# Altium project RFR24 AMS Design V1.PrjPcb (part 2 of 2)

## Sheet RFR24 AMS Design - Power Supply V1.SchDoc
size A; SheetNumber: 5; SheetTotal: 10
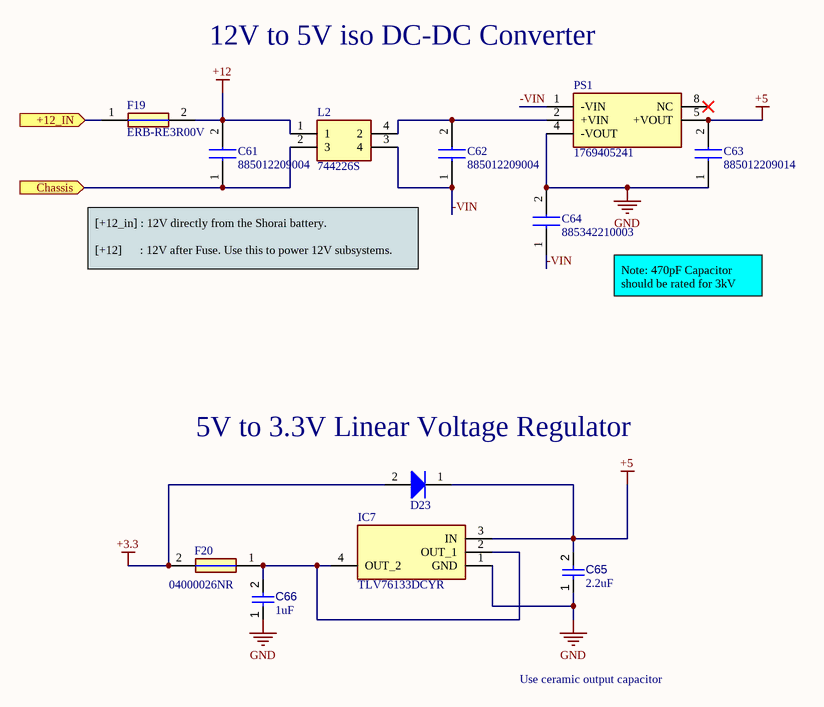
[diagram p4: RFR24 AMS Design - Power Supply V1.SchDoc]

### Parts
C61  885012209004  [CAPC3225X220N]
C62  885012209004  [CAPC3225X220N]
C63  885012209014  [CAPC3225X220N]
C64  885342210003  [CAPC4620X220N]
C65  value 2.2uF  [CAPC2013X145X50LL20T25]  (hidden comment: Capacitor 1 uF +/- 10% 25 V 0805)
C66  value 1uF  [CAPC2013X145X50LL20T25]  (hidden comment: Capacitor 1 uF +/- 10% 25 V 0805)
D23  unknown  [INF-SOD323_V]  (value not drawn)
F19  ERB-RE3R00V  [ERBRE0R50V]
F20  04000026NR  [FUSC1508X58N]
IC7  TLV76133DCYR  [SOT230P700X180-4N]
L2  744226S  [WE-SL274]
PS1  1769405241  [1769405241]

### Ports
+12_IN (in), Chassis (in)

### Nets
+3.3: D23.2(A) F20.2
+5: C63.2 C65.2 D23.1(K) IC7.3(IN) PS1.5(+VOUT)
+12: C61.2 F19.2 L2.1
GND: C63.1 C64.2 C65.1 C66.1 IC7.1(GND) PS1.4(-VOUT)
-VIN: C62.1 C64.1 L2.3(4) PS1.1(-VIN)
Chassis: C61.1 L2.2(3) ; port Chassis
NetC62_2: C62.2 L2.4(2) PS1.2(+VIN)
NetC66_2: C66.2 F20.1 IC7.2(OUT_1) IC7.4(OUT_2)
NetF19_1: F19.1 ; port +12_IN

Not connected (* = marked no-connect by the designer): PS1 8(NC)*

### Notes on the sheet
- 12V to 5V iso DC-DC Converter
- [+12_in] : 12V directly from the Shorai battery.
  [+12]      : 12V after Fuse. Use this to power 12V subsystems.
- Note: 470pF Capacitor should be rated for 3kV
- (near D23) 5V to 3.3V Linear Voltage Regulator
- Use ceramic output capacitor

### Library data of the parts
C61 C62 = 885012209004: Capacitor; Manufacturer_Name: Wurth Elektronik; Datasheet Link: https://katalog.we-online.com/pbs/datasheet/885012209004.pdf; Height: 2.2mm; Manufacturer_Part_Number: 885012209004; Mouser Part Number: 710-885012209004; Mouser Price/Stock: https://www.mouser.com/Search/Refine.aspx?Keyword=710-885012209004
C63 = 885012209014: Capacitor; Manufacturer_Name: Wurth Elektronik; Datasheet Link: https://katalog.we-online.com/pbs/datasheet/885012209014.pdf; Height: 2.2mm; Manufacturer_Part_Number: 885012209014; Mouser Part Number: 710-885012209014; Mouser Price/Stock: https://www.mouser.com/Search/Refine.aspx?Keyword=710-885012209014
C64 = 885342210003: Capacitor; Manufacturer_Name: Wurth Elektronik; Datasheet Link: https://katalog.we-online.com/pbs/datasheet/885342210003.pdf; Height: 2.2mm; Manufacturer_Part_Number: 885342210003; Mouser Part Number: 710-885342210003; Mouser Price/Stock: https://www.mouser.co.uk/ProductDetail/Wurth-Elektronik/885342210003?qs=MLItCLRbWsxO%2Fvro%2Fk5QUQ%3D%3D
C65 C66 = CMP-001-00010-6: Chip Capacitor, 1 uF, +/-10%, 25 V, 0805 (2012 Metric); Capacitor Type: Ceramic; Voltage Rating: 25V; RoHS Compliant: True; Pins: 2; Mounting Technology: SM; Max Operating Temperature: 125°C; Min Operating Temperature: -55°C; Tolerance: 10%; Case/Package: 0805
D23 = CMP-1182-00005-1: Silicon Schottky Diode, -55 to 125 degC, SOD323, Reel, Green; PartNumber: BAS170W; Manufacturer: Infineon; Green: TRUE; VF (max): 1,000Â mV; VR (max): 70Â V; Configuration: Single; CT (max): 2Â pF; IF (max): 70Â mA; PackageReference: SOD323; ComponentLink3URL: http://www.infineon.com/dgdl/SOD323-Package_Overview.pdf?folderId=db3a30431936bc4b011952aab84f3bbe&fileId=db3a30431936bc4b011952beed653be3; PackageDescription: 2-Pin Small Outline Diode Package, 1.25 x 1.7 mm Body; ComponentLink2URL: http://www.infineon.com/dgdl/bas70_bas170series.pdf?folderId=db3a30431400ef68011425f1ca2505e3&fileId=db3a304314dca389011518ad41680e12; ComponentLink3Description: Package Specification; ComponentLink1URL: http://www.infineon.com/; ComponentLink1Description: Manufacturer URL; Packing: Reel; ComponentLink2Description: Datasheet; Mounting Technology: Surface Mount
F19 = ERB-RE3R00V: Fuse; Manufacturer_Name: Panasonic; Datasheet Link: https://industrial.panasonic.com/cdbs/www-data/pdf/AFA0000/AFA0000C7.pdf; Height: 0.64mm; Manufacturer_Part_Number: ERB-RE3R00V; Mouser Part Number: 667-ERB-RE3R00V; Mouser Price/Stock: https://www.mouser.co.uk/ProductDetail/Panasonic/ERB-RE3R00V?qs=YIEcsSB2Lz476AVmswLSkg%3D%3D; Arrow Part Number: ERB-RE3R00V; Arrow Price/Stock: https://www.arrow.com/en/products/erbre3r00v/panasonic?region=nac
F20 = 04000026NR: Fuse; Manufacturer_Name: LITTELFUSE; Datasheet Link: https://www.mouser.com/catalog/specsheets/Littelfuse_07032019_Fuse_400M_Datasheet.pdf; Height: 0.582mm; Manufacturer_Part_Number: 04000026NR; Mouser Part Number: 576-04000026NR; Mouser Price/Stock: https://www.mouser.co.uk/ProductDetail/Littelfuse/04000026NR?qs=byeeYqUIh0MItL5FgjMqyw%3D%3D; Arrow Part Number: 04000026NR; Arrow Price/Stock: https://www.arrow.com/en/products/04000026nr/littelfuse?region=nac
IC7 = TLV76133DCYR: Integrated Circuit; Manufacturer_Name: Texas Instruments; Datasheet Link: https://www.ti.com/lit/ds/symlink/tlv761.pdf?ts=1679984111185&ref_url=https%253A%252F%252Fwww.ti.com%252Fsitesearch%252Fen-us%252Fdocs%252Funiversalsearch.tsp%253FlangPref%253Den-US%2526searchTerm%253DTLV76133DCYR%2526nr%253D2; Height: 1.8mm; Manufacturer_Part_Number: TLV76133DCYR; Mouser Part Number: 595-TLV76133DCYR; Mouser Price/Stock: https://www.mouser.co.uk/ProductDetail/Texas-Instruments/TLV76133DCYR?qs=9vOqFld9vZV5BPjUhjTZUA%3D%3D; Arrow Part Number: TLV76133DCYR; Arrow Price/Stock: https://www.arrow.com/en/products/tlv76133dcyr/texas-instruments?region=nac
L2 = 744226S: Inductor; Manufacturer_Name: Wurth Elektronik; Datasheet Link: http://componentsearchengine.com/Datasheets/3/744226S.pdf; Manufacturer_Part_Number: 744226S; Mouser Part Number: 710-744226S; Mouser Price/Stock: https://www.mouser.co.uk/ProductDetail/Wurth-Elektronik/744226S?qs=PGXP4M47uW7i1tILwHyAXg%3D%3D
PS1 = 1769405241: Power Supply; Manufacturer_Name: Wurth Elektronik; Datasheet Link: https://www.we-online.com/components/products/datasheet/1769405241.pdf; Height: 7.5mm; Manufacturer_Part_Number: 1769405241

## Sheet RFR24 AMS Design - CAN V1.SchDoc
size A; SheetNumber: 6; SheetTotal: 10
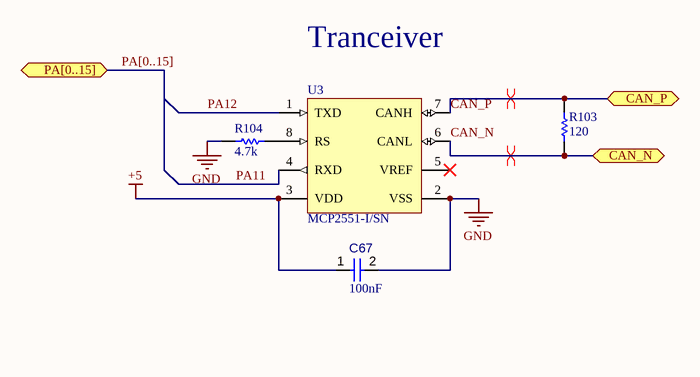
[diagram p5: RFR24 AMS Design - CAN V1.SchDoc]

### Parts
C67  value 100nF  [CAPC2013X145X50LL20T25]  (hidden comment: Capacitor 1 uF +/- 10% 25 V 0805)
R103  value 120  [RESC2013X70X40LL20T20]  (hidden comment: Resistor 1k +/-1% 0805 125 mW)  (no BOM)
R104  value 4.7k  [RESC2013X70X40LL20T20]  (hidden comment: Resistor 1k +/-1% 0805 125 mW)
U3  MCP2551-I/SN  [MCHP-SN8_V]

### Ports
CAN_N (bidir), CAN_P (bidir), PA[0..15] (bidir)

### Nets
+5: C67.1 U3.3(VDD)
GND: C67.2 R104.1 U3.2(VSS)
CAN_N: R103.2 U3.6(CANL) ; port CAN_N
CAN_P: R103.1 U3.7(CANH) ; port CAN_P
PA11: U3.4(RXD)
PA12: U3.1(TXD)
NetR104_2: R104.2 U3.8(RS)

Not connected (* = marked no-connect by the designer): U3 5(VREF)*

### Buses and harness runs
bus PA[0..15] = port PA[0..15]

### Layout directives
differential pair; rule Differential Pairs Routing [Pref Gap = 10mil    Min Gap  = 4mil    Max Gap  = 10milPref Width = 12mil    Min Width  = 7mil    Max Width  = 12mil]: CAN_P
differential pair: CAN_N

### Notes on the sheet
- Tranceiver

### Library data of the parts
C67 = CMP-001-00010-6: as C65 on sheet RFR24 AMS Design - Power Supply V1; RoHS Compliant: True; Pins: 2; Mounting Technology: SM; Max Operating Temperature: 125°C; Min Operating Temperature: -55°C; Tolerance: 10%; Case/Package: 0805
R103 R104 = CMP-009-00010-5: Chip Resistor, 1 KOhm, +/- 1%, 0.125 W, -55 to 155 degC, 0805 (2013 Metric); Power: 125mW; Voltage Rating: 150V; Tolerance: 1%; RoHS Compliant: True; Mounting Technology: SM; Pins: 2; Case/Package: 0805; Max Operating Temperature: 155°C; Min Operating Temperature: -55°C
U3 = CMP-0186-00138-3: High-Speed CAN Transceiver, / 1 Mb/s, 4.5 to 5.5 V, 8-Pin SOIC (SN), Industrial Temperature, RoHS, Tube; Manufacturer: Microchip; RoHSCompliant: true; PackageReference: SN8; ComponentLink1URL: http://www.microchip.com/; DatasheetVersion: Rev. F, 07/2010; ComponentLink2Description: Datasheet; ComponentLink2URL: http://ww1.microchip.com/downloads/en/DeviceDoc/21667f.pdf; ComponentLink3Description: Package Specification; PackageDescription: 8-Pin Small Outline Integrated Circuit, Body 4.9 x 3.9 mm, Pitch 1.27 mm; ComponentLink1Description: Manufacturer URL; Mounting Technology: Surface Mount; ComponentLink3URL: http://www.microchip.com/stellent/groups/techpub_sg/documents/packagingspec/en012702.pdf

## Sheet RFR24 AMS Design - EEPROM V1.SchDoc
size A; SheetNumber: 7; SheetTotal: 10
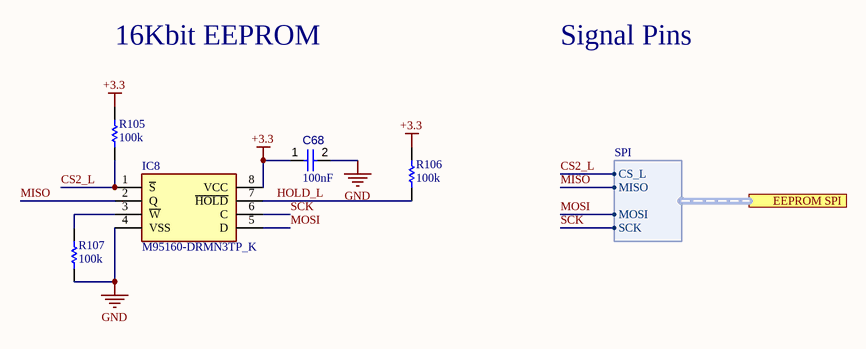
[diagram p6: RFR24 AMS Design - EEPROM V1.SchDoc]

### Parts
C68  value 100nF  [CAPC2013X145X50LL20T25]  (hidden comment: Capacitor 1 uF +/- 10% 25 V 0805)
IC8  M95160-DRMN3TP_K  [SOIC127P600X175-8N]
R105  value 100k  [RESC2013X70X40LL20T20]  (hidden comment: Resistor 1k +/-1% 0805 125 mW)
R106  value 100k  [RESC2013X70X40LL20T20]  (hidden comment: Resistor 1k +/-1% 0805 125 mW)
R107  value 100k  [RESC2013X70X40LL20T20]  (hidden comment: Resistor 1k +/-1% 0805 125 mW)

### Ports
EEPROM SPI (harness SPI)

### Harnesses
SPI: CS_L, MISO, MOSI, SCK

### Nets
+3.3: C68.1 IC8.8(VCC) R105.2 R106.2
GND: C68.2 IC8.4(VSS) R107.1
CS2_L: IC8.1(~{S}) R105.1 ; port EEPROM SPI.CS_L
HOLD_L: IC8.7(~{HOLD}) R106.1
MISO: IC8.2(Q) ; port EEPROM SPI.MISO
MOSI: IC8.5(D) ; port EEPROM SPI.MOSI
SCK: IC8.6(C) ; port EEPROM SPI.SCK  [project net PA5]
NetIC8_3: IC8.3(~{W}) R107.2

### Notes on the sheet
- 16Kbit EEPROM
- Signal Pins

### Library data of the parts
C68 = CMP-001-00010-6: as C65 on sheet RFR24 AMS Design - Power Supply V1; RoHS Compliant: True; Pins: 2; Mounting Technology: SM; Max Operating Temperature: 125°C; Min Operating Temperature: -55°C; Tolerance: 10%; Case/Package: 0805
IC8 = M95160-DRMN3TP_K: Integrated Circuit; Manufacturer_Name: STMicroelectronics; Manufacturer_Part_Number: M95160-DRMN3TP/K; Datasheet Link: https://www.mouser.jp/datasheet/2/389/dm00066376-1797784.pdf; Height: 1.75mm; Mouser Part Number: 511-M95160-DRMN3TP/K; Mouser Price/Stock: https://www.mouser.co.uk/ProductDetail/STMicroelectronics/M95160-DRMN3TP-K?qs=4ccVDqXDOrm%252BfzFwsEAdxA%3D%3D; Arrow Part Number: M95160-DRMN3TP/K; Arrow Price/Stock: https://www.arrow.com/en/products/m95160-drmn3tpk/stmicroelectronics?region=nac
R105-R107 = CMP-009-00010-5: as R103 on sheet RFR24 AMS Design - CAN V1; Tolerance: 1%; RoHS Compliant: True; Mounting Technology: SM; Pins: 2; Case/Package: 0805; Max Operating Temperature: 155°C; Min Operating Temperature: -55°C

## Sheet RFR24 AMS Design - Thermistors V1.SchDoc
size A; SheetNumber: 8; SheetTotal: 10
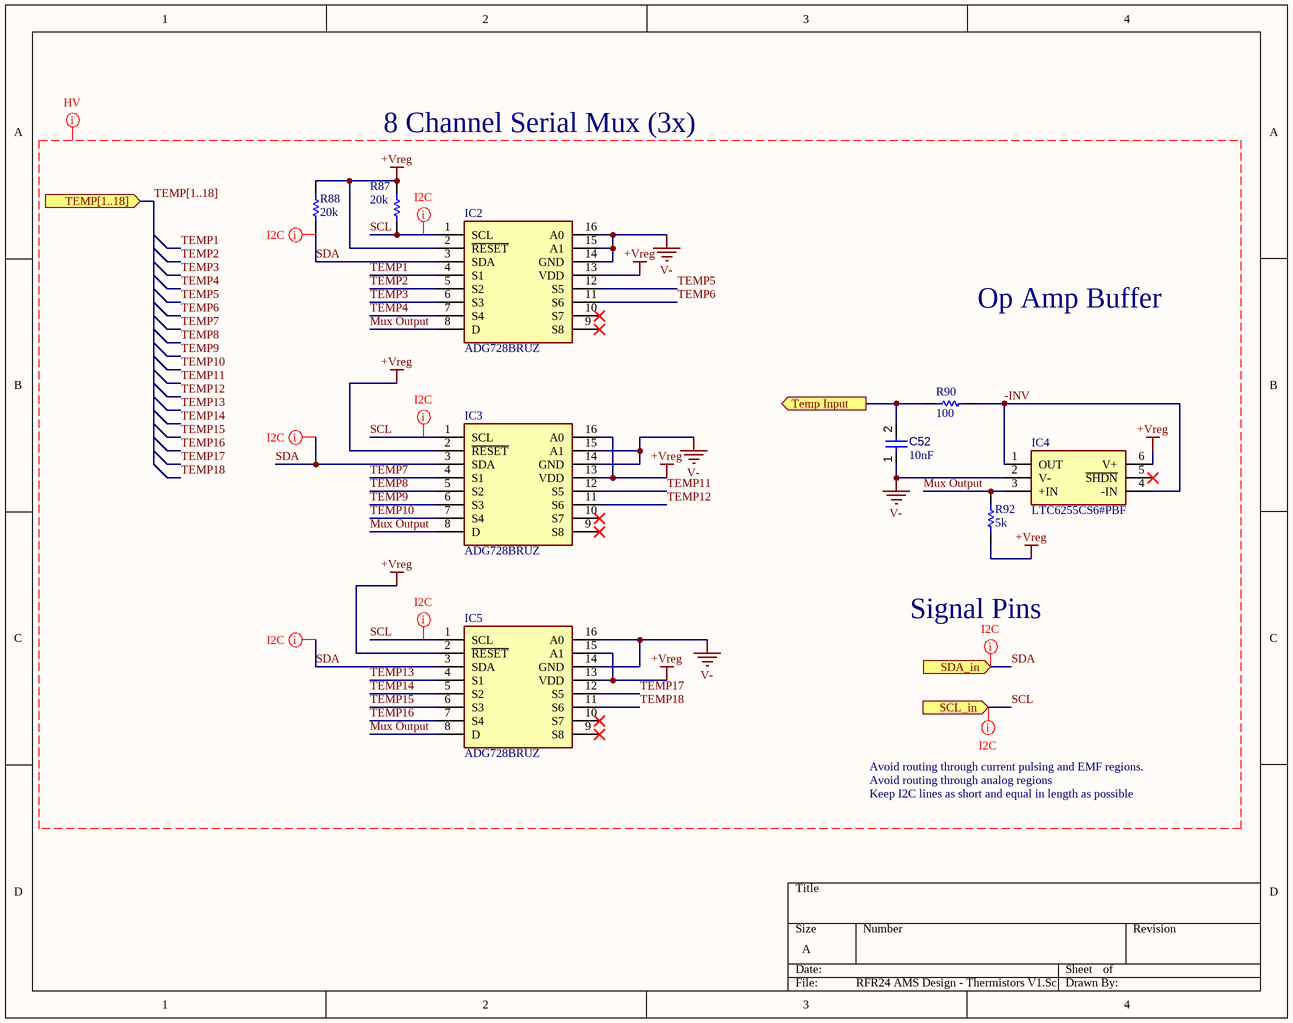
[diagram p7: RFR24 AMS Design - Thermistors V1.SchDoc]

### Parts
C52  value 10nF  [CAPC2013X145X50LL20T25]  (hidden comment: Capacitor 1 uF +/- 10% 25 V 0805)
IC2  ADG728BRUZ  [SOP65P640X120-16N]
IC3  ADG728BRUZ  [SOP65P640X120-16N]
IC4  LTC6255CS6#PBF  [SOT95P280X100-6N]
IC5  ADG728BRUZ  [SOP65P640X120-16N]
R87  value 20k  [RESC2013X70X40LL20T20]  (hidden comment: Resistor 1k +/-1% 0805 125 mW)
R88  value 20k  [RESC2013X70X40LL20T20]  (hidden comment: Resistor 1k +/-1% 0805 125 mW)
R90  value 100  [RESC2013X70X40LL20T20]  (hidden comment: Resistor 1k +/-1% 0805 125 mW)
R92  value 5k  [RESC2013X70X40LL20T20]  (hidden comment: Resistor 1k +/-1% 0805 125 mW)

### Ports
SCL_in (in), SDA_in (in), Temp Input (out), TEMP[1..18] (in)

### Nets
+Vreg: IC2.2(~{RESET}) IC2.13(VDD) IC3.2(~{RESET}) IC3.13(VDD) IC3.16(A0) IC4.6(V+) IC5.2(~{RESET}) IC5.13(VDD) IC5.15(A1) R87.2 R88.2 R92.1
V-: C52.1 IC2.14(GND) IC2.15(A1) IC2.16(A0) IC3.14(GND) IC3.15(A1) IC4.2(V-) IC5.14(GND) IC5.16(A0)
-INV: IC4.1(OUT) IC4.4(-IN) R90.1
Mux Output: IC2.8(D) IC3.8(D) IC4.3(+IN) IC5.8(D) R92.2
SCL: IC2.1(SCL) IC3.1(SCL) IC5.1(SCL) R87.1 ; port SCL_in
SDA: IC2.3(SDA) IC3.3(SDA) IC5.3(SDA) R88.1 ; port SDA_in
TEMP1: IC2.4(S1)
TEMP2: IC2.5(S2)
TEMP3: IC2.6(S3)
TEMP4: IC2.7(S4)
TEMP5: IC2.12(S5)
TEMP6: IC2.11(S6)
TEMP7: IC3.4(S1)
TEMP8: IC3.5(S2)
TEMP9: IC3.6(S3)
TEMP10: IC3.7(S4)
TEMP11: IC3.12(S5)
TEMP12: IC3.11(S6)
TEMP13: IC5.4(S1)
TEMP14: IC5.5(S2)
TEMP15: IC5.6(S3)
TEMP16: IC5.7(S4)
TEMP17: IC5.12(S5)
TEMP18: IC5.11(S6)
Temp Input: C52.2 R90.2 ; port Temp Input

Not connected (* = marked no-connect by the designer): IC2 9(S8)* 10(S7)*; IC3 9(S8)* 10(S7)*; IC4 5(~{SHDN})*; IC5 9(S8)* 10(S7)*

### Buses and harness runs
bus TEMP[1..18] = port TEMP[1..18]

### Layout directives
net class HV: +Vreg, -INV, Mux Output, SCL, SDA, TEMP1, TEMP2, TEMP3, TEMP4, TEMP5, TEMP6, TEMP7, TEMP8, TEMP9, TEMP10, TEMP11, TEMP12, TEMP13, TEMP14, TEMP15, TEMP16, TEMP17, TEMP18, TEMP[1..18], V-
rule Matched Net Lengths [Tolerance = 1000mil]; net class I2C: SCL, SDA

### Notes on the sheet
- 8 Channel Serial Mux (3x)
- Op Amp Buffer
- Signal Pins
- Avoid routing through current pulsing and EMF regions.
- Keep I2C lines as short and equal in length as possible
- Avoid routing through analog regions

### Library data of the parts
C52 = CMP-001-00010-6: as C65 on sheet RFR24 AMS Design - Power Supply V1; RoHS Compliant: True; Pins: 2; Mounting Technology: SM; Max Operating Temperature: 125°C; Min Operating Temperature: -55°C; Tolerance: 10%; Case/Package: 0805
IC2 IC3 IC5 = ADG728BRUZ: Integrated Circuit; Manufacturer_Name: Analog Devices; Datasheet Link: http://www.analog.com/static/imported-files/data_sheets/ADG728_729.pdf; Height: 1.2mm; Manufacturer_Part_Number: ADG728BRUZ; Mouser Part Number: 584-ADG728BRUZ; Mouser Price/Stock: https://www.mouser.co.uk/ProductDetail/Analog-Devices/ADG728BRUZ?qs=BpaRKvA4VqGXEyZecHfmEg%3D%3D; Arrow Part Number: ADG728BRUZ; Arrow Price/Stock: https://www.arrow.com/en/products/adg728bruz/analog-devices?region=europe
IC4 = LTC6255CS6#PBF: Integrated Circuit; Manufacturer_Name: Analog Devices; Datasheet Link: https://eu.mouser.com/ProductDetail/Analog-Devices/LTC6255CS6PBF?qs=hVkxg5c3xu%252Bj7bFOzXeTRA%3D%3D; Height: 1mm; Manufacturer_Part_Number: LTC6255CS6#PBF
R87 R88 R90 R92 = CMP-009-00010-5: as R103 on sheet RFR24 AMS Design - CAN V1; Tolerance: 1%; RoHS Compliant: True; Mounting Technology: SM; Pins: 2; Case/Package: 0805; Max Operating Temperature: 155°C; Min Operating Temperature: -55°C

## Sheet RFR24 AMS Design - Fuses V1.SchDoc
size A; SheetNumber: 9; SheetTotal: 10
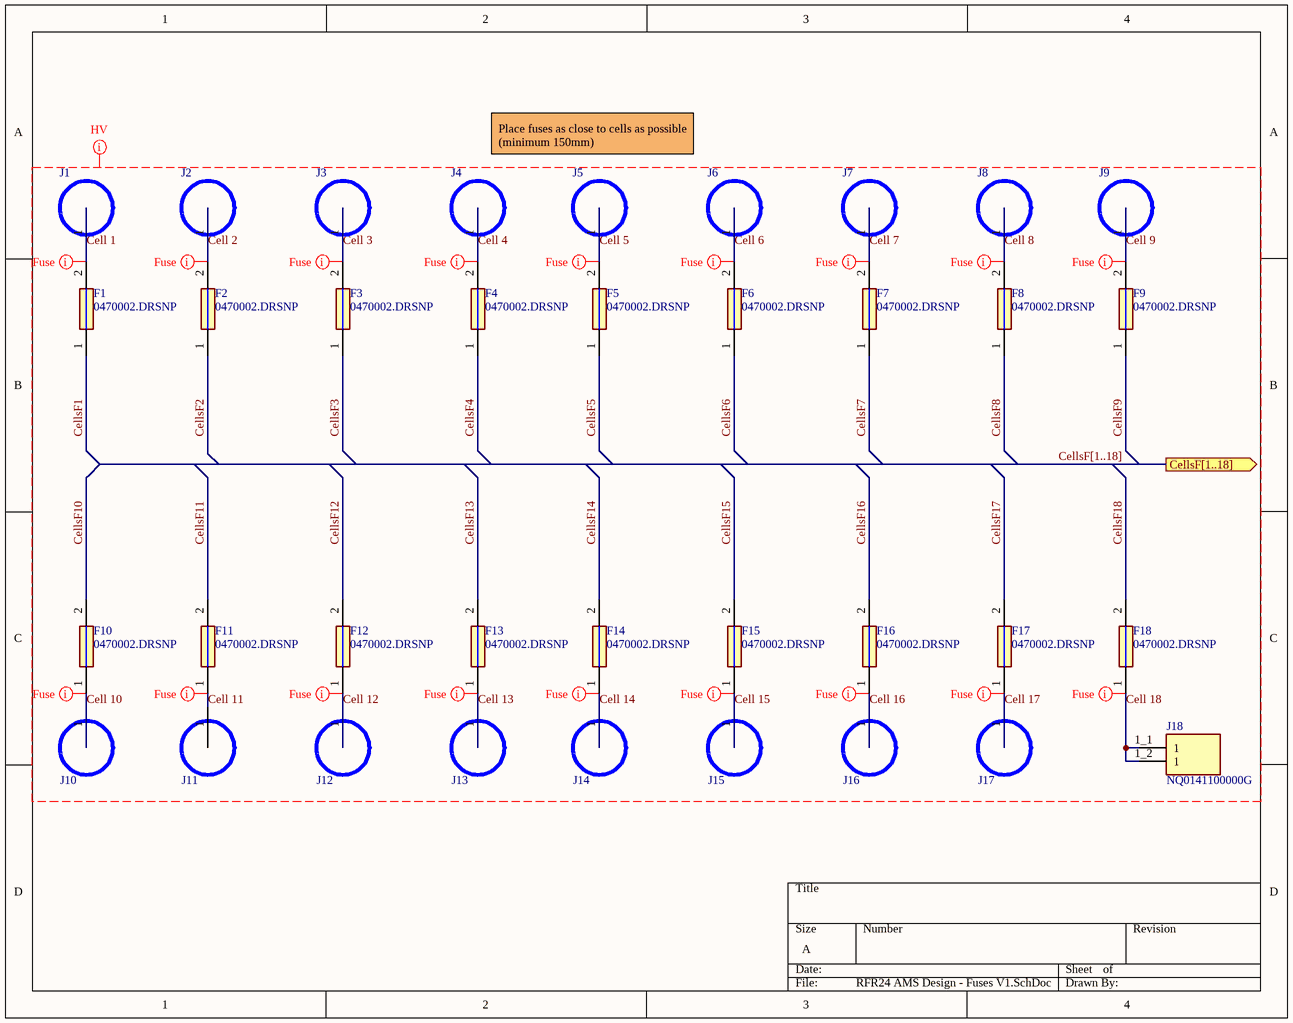
[diagram p8: RFR24 AMS Design - Fuses V1.SchDoc]

### Parts
F1  0470002.DRSNP  [0470002DRSNP]
F2  0470002.DRSNP  [0470002DRSNP]
F3  0470002.DRSNP  [0470002DRSNP]
F4  0470002.DRSNP  [0470002DRSNP]
F5  0470002.DRSNP  [0470002DRSNP]
F6  0470002.DRSNP  [0470002DRSNP]
F7  0470002.DRSNP  [0470002DRSNP]
F8  0470002.DRSNP  [0470002DRSNP]
F9  0470002.DRSNP  [0470002DRSNP]
F10  0470002.DRSNP  [0470002DRSNP]
F11  0470002.DRSNP  [0470002DRSNP]
F12  0470002.DRSNP  [0470002DRSNP]
F13  0470002.DRSNP  [0470002DRSNP]
F14  0470002.DRSNP  [0470002DRSNP]
F15  0470002.DRSNP  [0470002DRSNP]
F16  0470002.DRSNP  [0470002DRSNP]
F17  0470002.DRSNP  [0470002DRSNP]
F18  0470002.DRSNP  [0470002DRSNP]
J1  2900-3-15-20-75-14-11-0  [2900-3-15-20-75-14-11-0-Footprint-1]  (value not drawn)
J2  2900-3-15-20-75-14-11-0  [2900-3-15-20-75-14-11-0-Footprint-1]  (value not drawn)
J3  2900-3-15-20-75-14-11-0  [2900-3-15-20-75-14-11-0-Footprint-1]  (value not drawn)
J4  2900-3-15-20-75-14-11-0  [2900-3-15-20-75-14-11-0-Footprint-1]  (value not drawn)
J5  2900-3-15-20-75-14-11-0  [2900-3-15-20-75-14-11-0-Footprint-1]  (value not drawn)
J6  2900-3-15-20-75-14-11-0  [2900-3-15-20-75-14-11-0-Footprint-1]  (value not drawn)
J7  2900-3-15-20-75-14-11-0  [2900-3-15-20-75-14-11-0-Footprint-1]  (value not drawn)
J8  2900-3-15-20-75-14-11-0  [2900-3-15-20-75-14-11-0-Footprint-1]  (value not drawn)
J9  2900-3-15-20-75-14-11-0  [2900-3-15-20-75-14-11-0-Footprint-1]  (value not drawn)
J10  2900-3-15-20-75-14-11-0  [2900-3-15-20-75-14-11-0-Footprint-1]  (value not drawn)
J11  2900-3-15-20-75-14-11-0  [2900-3-15-20-75-14-11-0-Footprint-1]  (value not drawn)
J12  2900-3-15-20-75-14-11-0  [2900-3-15-20-75-14-11-0-Footprint-1]  (value not drawn)
J13  2900-3-15-20-75-14-11-0  [2900-3-15-20-75-14-11-0-Footprint-1]  (value not drawn)
J14  2900-3-15-20-75-14-11-0  [2900-3-15-20-75-14-11-0-Footprint-1]  (value not drawn)
J15  2900-3-15-20-75-14-11-0  [2900-3-15-20-75-14-11-0-Footprint-1]  (value not drawn)
J16  2900-3-15-20-75-14-11-0  [2900-3-15-20-75-14-11-0-Footprint-1]  (value not drawn)
J17  2900-3-15-20-75-14-11-0  [2900-3-15-20-75-14-11-0-Footprint-1]  (value not drawn)
J18  NQ0141100000G  [AMPHENOL_NQ0141100000G]

### Ports
CellsF[1..18] (out)

### Nets
Cell 1: F1.2 J1.1
Cell 2: F2.2 J2.1
Cell 3: F3.2 J3.1
Cell 4: F4.2 J4.1
Cell 5: F5.2 J5.1
Cell 6: F6.2 J6.1
Cell 7: F7.2 J7.1
Cell 8: F8.2 J8.1
Cell 9: F9.2 J9.1
Cell 10: F10.1 J10.1
Cell 11: F11.1 J11.1
Cell 12: F12.1 J12.1
Cell 13: F13.1 J13.1
Cell 14: F14.1 J14.1
Cell 15: F15.1 J15.1
Cell 16: F16.1 J16.1
Cell 17: F17.1 J17.1
Cell 18: F18.1 J18.1_1(1) J18.1_2(1)
CellsF1: F1.1
CellsF2: F2.1
CellsF3: F3.1
CellsF4: F4.1
CellsF5: F5.1
CellsF6: F6.1
CellsF7: F7.1
CellsF8: F8.1
CellsF9: F9.1
CellsF10: F10.2
CellsF11: F11.2
CellsF12: F12.2
CellsF13: F13.2
CellsF14: F14.2
CellsF15: F15.2
CellsF16: F16.2
CellsF17: F17.2
CellsF18: F18.2

### Buses and harness runs
bus CellsF[1..18] = port CellsF[1..18]

### Layout directives
net class HV; rule Width Constraint [Pref Width = 0.254mm    Min Width = 0.254mm    Max Width = 0.635mm]: Cell 1, Cell 2, Cell 3, Cell 4, Cell 5, Cell 6, Cell 7, Cell 8, Cell 9, Cell 10, Cell 11, Cell 12, Cell 13, Cell 14, Cell 15, Cell 16, Cell 17, Cell 18, CellsF1, CellsF2, CellsF3, CellsF4, CellsF5, CellsF6, CellsF7, CellsF8, CellsF9, CellsF10, CellsF11, CellsF12, CellsF13, CellsF14, CellsF15, CellsF16, CellsF17, CellsF18, CellsF[1..18]
net class Fuse; rule Length Constraint [Min Length = 0mm    Max Length = 150mm]: Cell 1, Cell 2, Cell 3, Cell 4, Cell 5, Cell 6, Cell 7, Cell 8, Cell 9, Cell 10, Cell 11, Cell 12, Cell 13, Cell 14, Cell 15, Cell 16, Cell 17, Cell 18

### Notes on the sheet
- Place fuses as close to cells as possible (minimum 150mm)

### Library data of the parts
F1-F18 = 0470002.DRSNP: Fuse; Manufacturer_Name: LITTELFUSE; Datasheet Link: http://m.littelfuse.com/~/media/electronics/datasheets/fuses/littelfuse_fuse_470_datasheet.pdf.pdf; Height: 1.168mm; Manufacturer_Part_Number: 0470002.DRSNP; Mouser Part Number: 576-0470002.DRSNP; Mouser Price/Stock: https://www.mouser.co.uk/ProductDetail/Littelfuse/0470002DRSNP?qs=gt1LBUVyoHlpmzfh2ZMJjA%3D%3D; Arrow Part Number: 0470002.DRSNP; Arrow Price/Stock: https://www.arrow.com/en/products/0470002.drsnp/littelfuse
J1-J17 = CMP-002-00072-2: https://www.mouser.com/datasheet/2/273/Mil_Max_7_10_2023_2900_3_15_20_75_14_11_0_DSL-3236111.pdf
J18 = NQ0141100000G: 1 Position Wire to Board Terminal Block Horizontal with Board Surface Mount; MF: Amphenol Anytek; Package: None; Check_prices: https://www.snapeda.com/parts/NQ0141100000G/Amphenol/view-part/?ref=eda; Availability: In Stock; Value: *; MP: NQ0141100000G; SnapEDA_Link: https://www.snapeda.com/parts/NQ0141100000G/Amphenol/view-part/?ref=snap; Price: None; Purchase-URL: https://pricing.snapeda.com/search/part/NQ0141100000G/?ref=eda

## Sheet RFR24 AMS Design - Fault V1.SchDoc
size A; SheetNumber: 10; SheetTotal: 10
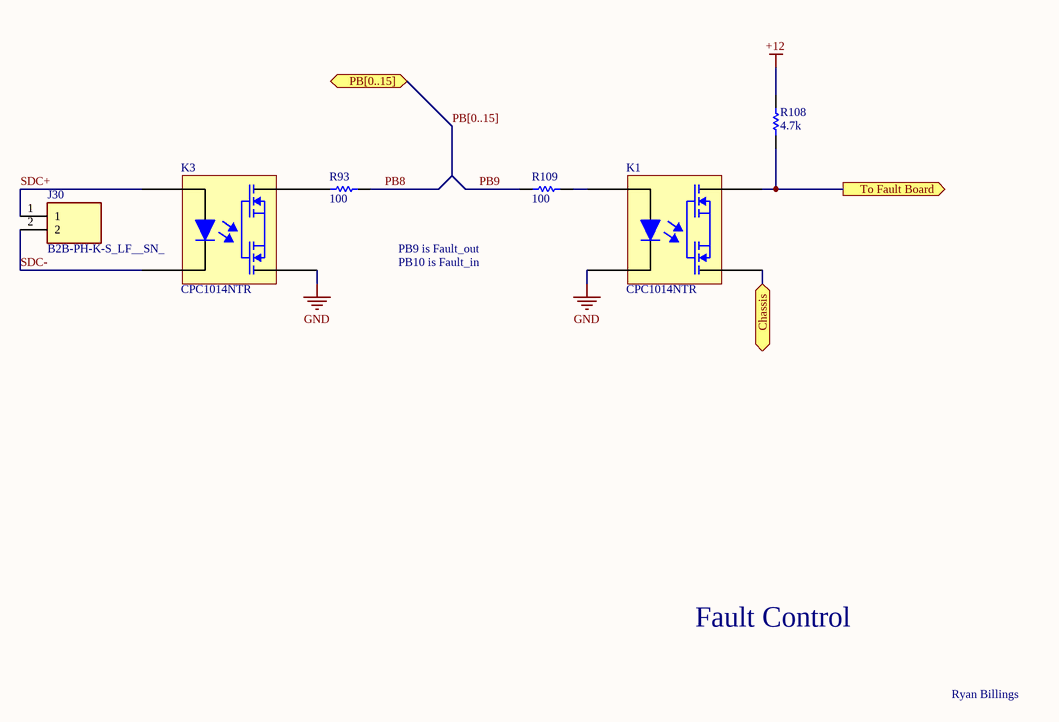
[diagram p9: RFR24 AMS Design - Fault V1.SchDoc]

### Parts
J30  B2B-PH-K-S_LF__SN_  [SHDR2W50P0X200_1X2_590X450X600P]
K1  CPC1014NTR  [CPC1014]
K3  CPC1014NTR  [CPC1014]
R93  value 100  [RESC2013X70X40LL20T20]  (hidden comment: Resistor 1k +/-1% 0805 125 mW)
R108  value 4.7k  [RESC2013X70X40LL20T20]  (hidden comment: Resistor 1k +/-1% 0805 125 mW)
R109  value 100  [RESC2013X70X40LL20T20]  (hidden comment: Resistor 1k +/-1% 0805 125 mW)

### Ports
Chassis (bidir), PB[0..15] (bidir), To Fault Board (out)

### Nets
+12: R108.2
GND: K1.2 K3.3
Chassis: K1.3 ; port Chassis
Fault_out: K1.4 R108.1 ; port To Fault Board
PB8: R93.1
PB9: R109.2
SDC+: J30.1 K3.1
SDC-: J30.2 K3.2
NetK1_1: K1.1 R109.1
NetK3_4: K3.4 R93.2

### Buses and harness runs
bus PB[0..15] = port PB[0..15]

### Notes on the sheet
- PB9 is Fault_out
- PB10 is Fault_in
- Fault Control
- Ryan Billings

### Library data of the parts
J30 = B2B-PH-K-S_LF__SN_: Connector; Manufacturer_Name: JST (JAPAN SOLDERLESS TERMINALS); Manufacturer_Part_Number: B2B-PH-K-S(LF)(SN); Datasheet Link: https://datasheet.lcsc.com/szlcsc/JST-Sales-America-B2B-PH-K-S-LF-SN_C131337.pdf; Height: 6mm; Arrow Part Number: B2B-PH-K-S(LF)(SN); Arrow Price/Stock: https://www.arrow.com/en/products/b2b-ph-k-s-lf-sn/jst-manufacturing?region=europe
K1 K3 = CMP-329-000002-2: SSR RELAY SPST-NO (1 Form A) 4-SOP (0.150", 3.81mm); Component Type: Standard; ComponentLink1URL: https://www.digikey.com/en/products/detail/ixys-integrated-circuits-division/CPC1014NTR/1973284; Source: CPC1014NTR.SchLib; ComponentLink2Description: Datasheet; Pin Count: 4; ComponentLink2URL: https://www.ixysic.com/home/pdfs.nsf/www/CPC1014N.pdf/$file/CPC1014N.pdf; ComponentLink1Description: DigiKey Link; Design Item ID: IXYS CPC1014NTR
R93 R108 R109 = CMP-009-00010-5: as R103 on sheet RFR24 AMS Design - CAN V1; Tolerance: 1%; RoHS Compliant: True; Mounting Technology: SM; Pins: 2; Case/Package: 0805; Max Operating Temperature: 155°C; Min Operating Temperature: -55°C

## Nets that join several sheets
+3.3: RFR24 AMS Design - LTC6820 V1 (6 pins), RFR24 AMS Design - Microcontroller V1 (10 pins), RFR24 AMS Design - Power Supply V1 (D23.2 F20.2), RFR24 AMS Design - EEPROM V1 (C68.1 IC8.8 R105.2 R106.2)
+5: RFR24 AMS Design - Top Level V1 (J26.2), RFR24 AMS Design - Power Supply V1 (5 pins), RFR24 AMS Design - CAN V1 (C67.1 U3.3)
+12: RFR24 AMS Design - Power Supply V1 (C61.2 F19.2 L2.1), RFR24 AMS Design - Fault V1 (R108.2)
+Vreg: RFR24 AMS Design - LTC6813 V1 (7 pins), RFR24 AMS Design - Thermistors V1 (12 pins)
GND: RFR24 AMS Design - Top Level V1 (J26.1), RFR24 AMS Design - LTC6820 V1 (12 pins), RFR24 AMS Design - Microcontroller V1 (18 pins), RFR24 AMS Design - Power Supply V1 (6 pins), RFR24 AMS Design - CAN V1 (C67.2 R104.1 U3.2), RFR24 AMS Design - EEPROM V1 (C68.2 IC8.4 R107.1), RFR24 AMS Design - Fault V1 (K1.2 K3.3)
V-: RFR24 AMS Design - Top Level V1 (J27.10 J28.10), RFR24 AMS Design - LTC6813 V1 (42 pins), RFR24 AMS Design - Thermistors V1 (9 pins)
CAN_N: RFR24 AMS Design - Top Level V1 (J24.2), RFR24 AMS Design - CAN V1 (R103.2 U3.6)
CAN_P: RFR24 AMS Design - Top Level V1 (J24.1), RFR24 AMS Design - CAN V1 (R103.1 U3.7)
Cell 0: RFR24 AMS Design - Top Level V1 (J22.1_1 J22.1_2), RFR24 AMS Design - LTC6813 V1 (5 pins)
CellsF1: RFR24 AMS Design - LTC6813 V1 (5 pins), RFR24 AMS Design - Fuses V1 (F1.1)
CellsF2: RFR24 AMS Design - LTC6813 V1 (Q2.2 R3.2 R21.1 R48.1), RFR24 AMS Design - Fuses V1 (F2.1)
CellsF3: RFR24 AMS Design - LTC6813 V1 (Q3.2 R4.2 R22.1 R49.1), RFR24 AMS Design - Fuses V1 (F3.1)
CellsF4: RFR24 AMS Design - LTC6813 V1 (Q4.2 R5.2 R23.1 R50.1), RFR24 AMS Design - Fuses V1 (F4.1)
CellsF5: RFR24 AMS Design - LTC6813 V1 (Q5.2 R6.2 R24.1 R51.1), RFR24 AMS Design - Fuses V1 (F5.1)
CellsF6: RFR24 AMS Design - LTC6813 V1 (Q6.2 R7.2 R25.1 R52.1), RFR24 AMS Design - Fuses V1 (F6.1)
CellsF7: RFR24 AMS Design - LTC6813 V1 (Q7.2 R8.2 R26.1 R53.1), RFR24 AMS Design - Fuses V1 (F7.1)
CellsF8: RFR24 AMS Design - LTC6813 V1 (Q8.2 R9.2 R27.1 R54.1), RFR24 AMS Design - Fuses V1 (F8.1)
CellsF9: RFR24 AMS Design - LTC6813 V1 (Q9.2 R10.2 R28.1 R55.1), RFR24 AMS Design - Fuses V1 (F9.1)
CellsF10: RFR24 AMS Design - LTC6813 V1 (Q10.2 R11.2 R29.1 R65.1), RFR24 AMS Design - Fuses V1 (F10.2)
CellsF11: RFR24 AMS Design - LTC6813 V1 (Q11.2 R12.2 R30.1 R66.1), RFR24 AMS Design - Fuses V1 (F11.2)
CellsF12: RFR24 AMS Design - LTC6813 V1 (Q12.2 R13.2 R31.1 R67.1), RFR24 AMS Design - Fuses V1 (F12.2)
CellsF13: RFR24 AMS Design - LTC6813 V1 (Q13.2 R14.2 R32.1 R68.1), RFR24 AMS Design - Fuses V1 (F13.2)
CellsF14: RFR24 AMS Design - LTC6813 V1 (Q14.2 R15.2 R33.1 R69.1), RFR24 AMS Design - Fuses V1 (F14.2)
CellsF15: RFR24 AMS Design - LTC6813 V1 (Q15.2 R16.2 R34.1 R70.1), RFR24 AMS Design - Fuses V1 (F15.2)
CellsF16: RFR24 AMS Design - LTC6813 V1 (Q16.2 R17.2 R35.1 R71.1), RFR24 AMS Design - Fuses V1 (F16.2)
CellsF17: RFR24 AMS Design - LTC6813 V1 (Q17.2 R18.2 R36.1 R72.1), RFR24 AMS Design - Fuses V1 (F17.2)
CellsF18: RFR24 AMS Design - LTC6813 V1 (K2.3 Q18.2 R73.1 R74.1), RFR24 AMS Design - Fuses V1 (F18.2)
Chassis: RFR24 AMS Design - Top Level V1 (J23.1), RFR24 AMS Design - Power Supply V1 (C61.1 L2.2), RFR24 AMS Design - Fault V1 (K1.3)
CS1_L: RFR24 AMS Design - LTC6820 V1 (R99.1 U2.5), RFR24 AMS Design - Microcontroller V1 (IC6.42)
CS2_L: RFR24 AMS Design - Microcontroller V1 (IC6.43), RFR24 AMS Design - EEPROM V1 (IC8.1 R105.1)
Fault_out: RFR24 AMS Design - Top Level V1 (J26.4), RFR24 AMS Design - Fault V1 (K1.4 R108.1)
LTC6820 IM: RFR24 AMS Design - LTC6813 V1 (J19.1 T2.4), RFR24 AMS Design - LTC6820 V1 (J25.1 T3.4)
LTC6820 IP: RFR24 AMS Design - LTC6813 V1 (J19.2 T2.6), RFR24 AMS Design - LTC6820 V1 (J25.2 T3.6)
MISO: RFR24 AMS Design - LTC6820 V1 (R97.1 U2.3), RFR24 AMS Design - Microcontroller V1 (IC6.16), RFR24 AMS Design - EEPROM V1 (IC8.2)
MOSI: RFR24 AMS Design - LTC6820 V1 (U2.2), RFR24 AMS Design - Microcontroller V1 (IC6.17), RFR24 AMS Design - EEPROM V1 (IC8.5)
NetF19_1: RFR24 AMS Design - Top Level V1 (J23.2), RFR24 AMS Design - Power Supply V1 (F19.1)
PA0: RFR24 AMS Design - Top Level V1 (J26.7), RFR24 AMS Design - Microcontroller V1 (IC6.10)
PA1: RFR24 AMS Design - Top Level V1 (J26.3), RFR24 AMS Design - Microcontroller V1 (R101.1)
PA2: RFR24 AMS Design - Top Level V1 (J26.5), RFR24 AMS Design - Microcontroller V1 (IC6.12)
PA3: RFR24 AMS Design - Top Level V1 (J26.6), RFR24 AMS Design - Microcontroller V1 (IC6.13)
PA5: RFR24 AMS Design - LTC6820 V1 (R98.2 U2.4), RFR24 AMS Design - Microcontroller V1 (IC6.15), RFR24 AMS Design - EEPROM V1 (IC8.6)
PA11: RFR24 AMS Design - Microcontroller V1 (IC6.32), RFR24 AMS Design - CAN V1 (U3.4)
PA12: RFR24 AMS Design - Microcontroller V1 (IC6.33), RFR24 AMS Design - CAN V1 (U3.1)
PB0: RFR24 AMS Design - Top Level V1 (J26.8), RFR24 AMS Design - Microcontroller V1 (IC6.18)
PB8: RFR24 AMS Design - Microcontroller V1 (IC6.45), RFR24 AMS Design - Fault V1 (R93.1)
PB9: RFR24 AMS Design - Microcontroller V1 (IC6.46), RFR24 AMS Design - Fault V1 (R109.2)
PB10: RFR24 AMS Design - Top Level V1 (J26.9), RFR24 AMS Design - Microcontroller V1 (IC6.21)
PB11: RFR24 AMS Design - Top Level V1 (J26.10), RFR24 AMS Design - Microcontroller V1 (IC6.22)
SCL: RFR24 AMS Design - LTC6813 V1 (U1.43), RFR24 AMS Design - Thermistors V1 (IC2.1 IC3.1 IC5.1 R87.1)
SDA: RFR24 AMS Design - LTC6813 V1 (U1.42), RFR24 AMS Design - Thermistors V1 (IC2.3 IC3.3 IC5.3 R88.1)
TEMP1: RFR24 AMS Design - Top Level V1 (J27.1), RFR24 AMS Design - Thermistors V1 (IC2.4)
TEMP2: RFR24 AMS Design - Top Level V1 (J27.2), RFR24 AMS Design - Thermistors V1 (IC2.5)
TEMP3: RFR24 AMS Design - Top Level V1 (J27.3), RFR24 AMS Design - Thermistors V1 (IC2.6)
TEMP4: RFR24 AMS Design - Top Level V1 (J27.4), RFR24 AMS Design - Thermistors V1 (IC2.7)
TEMP5: RFR24 AMS Design - Top Level V1 (J27.5), RFR24 AMS Design - Thermistors V1 (IC2.12)
TEMP6: RFR24 AMS Design - Top Level V1 (J27.6), RFR24 AMS Design - Thermistors V1 (IC2.11)
TEMP7: RFR24 AMS Design - Top Level V1 (J27.7), RFR24 AMS Design - Thermistors V1 (IC3.4)
TEMP8: RFR24 AMS Design - Top Level V1 (J27.8), RFR24 AMS Design - Thermistors V1 (IC3.5)
TEMP9: RFR24 AMS Design - Top Level V1 (J27.9), RFR24 AMS Design - Thermistors V1 (IC3.6)
TEMP10: RFR24 AMS Design - Top Level V1 (J28.1), RFR24 AMS Design - Thermistors V1 (IC3.7)
TEMP11: RFR24 AMS Design - Top Level V1 (J28.2), RFR24 AMS Design - Thermistors V1 (IC3.12)
TEMP12: RFR24 AMS Design - Top Level V1 (J28.3), RFR24 AMS Design - Thermistors V1 (IC3.11)
TEMP13: RFR24 AMS Design - Top Level V1 (J28.4), RFR24 AMS Design - Thermistors V1 (IC5.4)
TEMP14: RFR24 AMS Design - Top Level V1 (J28.5), RFR24 AMS Design - Thermistors V1 (IC5.5)
TEMP15: RFR24 AMS Design - Top Level V1 (J28.6), RFR24 AMS Design - Thermistors V1 (IC5.6)
TEMP16: RFR24 AMS Design - Top Level V1 (J28.7), RFR24 AMS Design - Thermistors V1 (IC5.7)
TEMP17: RFR24 AMS Design - Top Level V1 (J28.8), RFR24 AMS Design - Thermistors V1 (IC5.12)
TEMP18: RFR24 AMS Design - Top Level V1 (J28.9), RFR24 AMS Design - Thermistors V1 (IC5.11)
Temp Input: RFR24 AMS Design - LTC6813 V1 (U1.39), RFR24 AMS Design - Thermistors V1 (C52.2 R90.2)